# Altium project PCB_Project1.PrjPCB
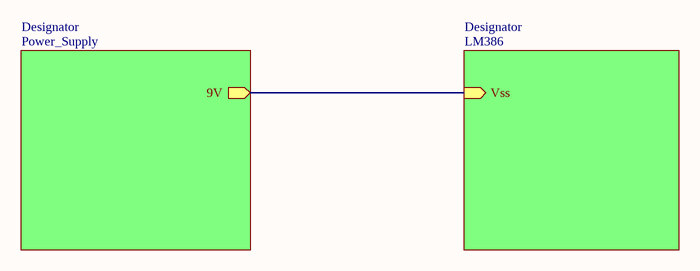
[diagram p0: Sheet1.SchDoc]
3 sheets, 38 parts. Net scope: hierarchical (ports join the sheet entries above them; power ports are global).
Sheets:
  Sheet1.SchDoc
    Designator = Power_Supply.SchDoc
    Designator = LM386.SchDoc

## Sheet Sheet1.SchDoc
size A4

### Sub-sheets
Designator = Power_Supply: 9V (out)
Designator = LM386: Vss (in)

### Nets
NetC11_2: sheet Designator/9V, sheet Designator/Vss

## Sheet Power_Supply.SchDoc
size A4
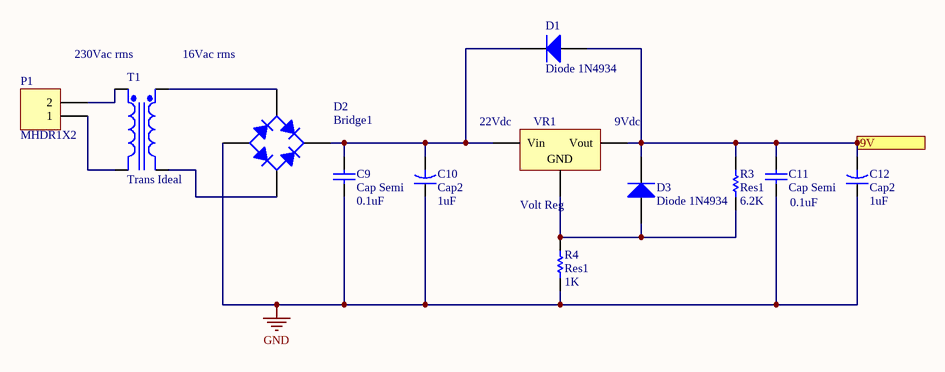
[diagram p1: Power_Supply.SchDoc]

### Parts
(Parts that share a designator on the sheet are numbered #1, #2 ... from top to bottom, then left to right.)
C9#1  Cap Semi  value 0.1uF  [C1206]
C10#1  Cap2  value 1uF  [CAPR5-4X5]
C11  Cap Semi  value 0.1uF  [C1206]
C12  Cap2  value 1uF  [CAPR5-4X5]
D1  Diode 1N4934  [DO-41]
D2  Bridge1  [D-38]
D3  Diode 1N4934  [DO-41]
P1  MHDR1X2  [MHDR1X2]
R3  Res1  value 6.2K  [AXIAL-0.3]
R4  Res1  value 1K  [AXIAL-0.3]
T1  Trans Ideal  [TRF_4]
VR1  Volt Reg  [D2PAK_N]

### Ports
9V (out)

### Nets
GND: C9#1.1 C10#1.1 C11.1 C12.1 D2.3(A) R4.1
NetC9#1_2: C9#1.2 C10#1.2 D1.2(K) D2.1(K) VR1.1(Vin)
NetC11_2: C11.2 C12.2 D1.1(A) D3.2(K) R3.1 VR1.3(Vout) ; port 9V
NetD2_2: D2.2(C) T1.4(Sec-)
NetD2_4: D2.4(C) T1.3(Sec+)
NetD3_1: D3.1(A) R3.2 R4.2 VR1.2(GND)
NetP1_1: P1.1 T1.2(Pri-)
NetP1_2: P1.2 T1.1(Pri+)

### Notes on the sheet
- 230Vac rms
- 16Vac rms
- (near VR1) 22Vdc
- (near VR1) 9Vdc

### Library data of the parts
C9#1 C11 = Cap Semi: Capacitor (Semiconductor SIM Model); Published: 8-Jun-2000; LatestRevisionDate: 29-May-2009; LatestRevisionNote: IPC-7351 Footprint Added.; PackageReference: C1206; Publisher: Altium Limited; PackageDescription: Chip Capacitor
C10#1 C12 = Cap2: Capacitor; Published: 23-Sep-2002; PackageReference: CAPR5-4X5; Publisher: Altium Limited; PackageDescription: Capacitor; 2 Leads
D1 D3 = Diode 1N4934: 1 Amp Fast Recovery Rectifier; Published: 8-Jun-2000; LatestRevisionDate: 17-Jul-2002; LatestRevisionNote: Re-released for DXP Platform.; DatasheetVersion: 1999; PackageVersion: Aug-1999; PackageReference: DO-41; Publisher: Altium Limited; PackageDescription: Diode, Axial; Body 5.2 x 2.7 mm (LxDia. max), Lead Dia. 0.86 mm (max); Code_JEDEC: DO-204-AL; ComponentLink1Description: Manufacturer Link; ComponentLink1URL: http://www.fairchildsemi.com/; ComponentLink2Description: Datasheet; ComponentLink2URL: http://www.fairchildsemi.com/ds/1N%2F1N4934.pdf
D2 = Bridge1: Full Wave Diode Bridge; Published: 8-Jun-2000; LatestRevisionDate: 29-May-2009; LatestRevisionNote: Sch pins A & K swapped.; DatasheetVersion: E2732B; PackageReference: D-38; Publisher: Altium Limited; PackageDescription: Bridge Rectifier; 4 Terminals; Body 9.4 x 9.4 mm (typ); Pitch 5.08 mm
P1 = MHDR1X2: Header, 2-Pin; LatestRevisionDate: 17-Jul-2002; LatestRevisionNote: Re-released for DXP Platform.; Publisher: Altium Limited
R3 R4 = Res1: Resistor; Published: 8-Jun-2000; LatestRevisionDate: 17-Jul-2002; LatestRevisionNote: Re-released for DXP Platform.; PackageReference: AXIAL-0.3; Publisher: Altium Limited; PackageDescription: Axial Device, Thru-Hole; 2 Leads; 0.3 in Pin Spacing
T1 = Trans Ideal: Transformer (Ideal); Published: 8-Jun-2000; LatestRevisionDate: 17-Jul-2002; LatestRevisionNote: Re-released for DXP Platform.; PackageReference: TRF_4; Publisher: Altium Limited; PackageDescription: Transformer; 4 Leads
VR1 = Volt Reg: Voltage Regulator; Published: 24-Mar-1999; LatestRevisionDate: 29-May-2009; LatestRevisionNote: IPC-7351 Footprint Added.; PackageReference: D2PAK; Publisher: Altium Limited; PackageDescription: 3-Pin Transistor Outline Package 2.54 mm Pitch, 15.1 mm Lead Span

## Sheet LM386.SchDoc
size A4
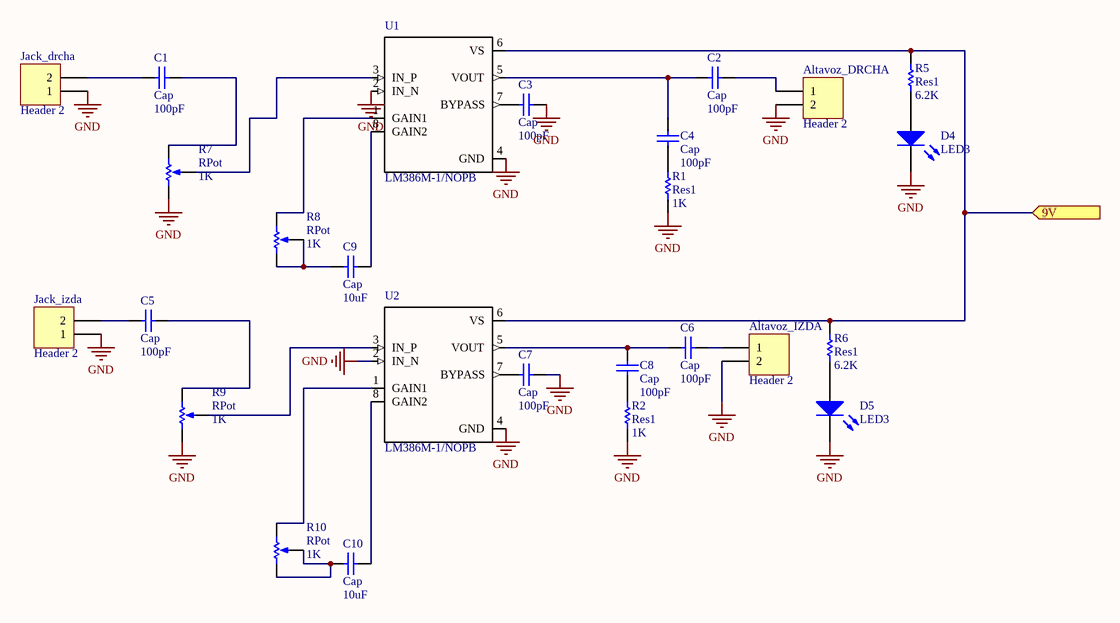
[diagram p2: LM386.SchDoc]

### Parts
(Parts that share a designator on the sheet are numbered #1, #2 ... from top to bottom, then left to right.)
Altavoz_DRCHA  Header 2  [HDR1X2]
Altavoz_IZDA  Header 2  [HDR1X2]
C1  Cap  value 100pF  [RAD-0.3]
C2  Cap  value 100pF  [RAD-0.3]
C3  Cap  value 100pF  [RAD-0.3]
C4  Cap  value 100pF  [RAD-0.3]
C5  Cap  value 100pF  [RAD-0.3]
C6  Cap  value 100pF  [RAD-0.3]
C7  Cap  value 100pF  [RAD-0.3]
C8  Cap  value 100pF  [RAD-0.3]
C9#2  Cap  value 10uF  [RAD-0.3]
C10#2  Cap  value 10uF  [RAD-0.3]
D4  LED3  [3.5X2.8X1.9]
D5  LED3  [3.5X2.8X1.9]
Jack_drcha  Header 2  [HDR1X2]
Jack_izda  Header 2  [HDR1X2]
R1  Res1  value 1K  [AXIAL-0.3]
R2  Res1  value 1K  [AXIAL-0.3]
R5  Res1  value 6.2K  [AXIAL-0.3]
R6  Res1  value 6.2K  [AXIAL-0.3]
R7  RPot  value 1K  [SOIC127P600X175-8N]
R8  RPot  value 1K  [VR5]
R9  RPot  value 1K  [VR5]
R10  RPot  value 1K  [VR5]
U1  LM386M-1/NOPB  [SOIC127P600X175-8N]
U2  LM386M-1/NOPB  [SOIC127P600X175-8N]

### Ports
9V (in)

### Nets
GND: Altavoz_DRCHA.2 Altavoz_IZDA.2 C3.1 C7.2 D4.2(K) D5.2(K) Jack_drcha.1 Jack_izda.1 R1.1 R2.1 R7.1(TOP) R9.1(TOP) U1.2(IN_N) U1.4(GND) U2.2(IN_N) U2.4(GND)
NetAltavoz_DRCHA_1: Altavoz_DRCHA.1 C2.2
NetAltavoz_IZDA_1: Altavoz_IZDA.1 C6.2
NetC1_1: C1.1 R7.2(BOT)
NetC1_2: C1.2 Jack_drcha.2
NetC2_1: C2.1 C4.2 U1.5(VOUT)
NetC3_2: C3.2 U1.7(BYPASS)
NetC4_1: C4.1 R1.2
NetC5_1: C5.1 R9.2(BOT)
NetC5_2: C5.2 Jack_izda.2
NetC6_1: C6.1 C8.2 U2.5(VOUT)
NetC7_1: C7.1 U2.7(BYPASS)
NetC8_1: C8.1 R2.2
NetC9#2_1: C9#2.1 U1.8(GAIN2)
NetC9#2_2: C9#2.2 R8.1(TOP) R8.3(TAP)
NetC10#2_1: C10#2.1 U2.8(GAIN2)
NetC10#2_2: C10#2.2 R10.1(TOP) R10.3(TAP)
NetD4_1: D4.1(A) R5.2
NetD5_1: D5.1(A) R6.2
NetR5_1: R5.1 R6.1 U1.6(VS) U2.6(VS) ; port 9V
NetR7_3: R7.3(TAP) U1.3(IN_P)
NetR8_2: R8.2(BOT) U1.1(GAIN1)
NetR9_3: R9.3(TAP) U2.3(IN_P)
NetR10_2: R10.2(BOT) U2.1(GAIN1)

### Library data of the parts
Altavoz_DRCHA Altavoz_IZDA Jack_drcha Jack_izda = Header 2: Header, 2-Pin; LatestRevisionDate: 17-Jul-2002; LatestRevisionNote: Re-released for DXP Platform.; Publisher: Altium Limited
C1-C8 C9#2 C10#2 = Cap: Capacitor; Published: 8-Jun-2000; LatestRevisionDate: 17-Jul-2002; LatestRevisionNote: Re-released for DXP Platform.; PackageReference: RAD-0.3; Publisher: Altium Limited; PackageDescription: Radial Cap, Thru-Hole; 2 Leads; 0.3 in Pin Spacing
D4 D5 = LED3: Typical BLUE SiC LED; Published: 8-Jun-2000; LatestRevisionDate: 17-Dec-2003; LatestRevisionNote: PCB Footprint replaced.; DatasheetVersion: 16-Apr-2002; PackageVersion: 16-Apr-2002; PackageReference: 3.5X2.8X1.9; Publisher: Altium Limited; PackageDescription: SM LED; 2 C-Bend Leads; Body 3.5 x 2.8 x 1.9 mm, inc leads (LxWxH typ)
R1 R2 R5 R6 = Res1: Resistor; Published: 8-Jun-2000; LatestRevisionDate: 17-Jul-2002; LatestRevisionNote: Re-released for DXP Platform.; PackageReference: AXIAL-0.3; Publisher: Altium Limited; PackageDescription: Axial Device, Thru-Hole; 2 Leads; 0.3 in Pin Spacing
R7-R10 = RPot: Potentiometer; Sim Note: Enter the Resistance value and the set point into parameter fields.; Set Position: 0.5; Published: 8-Jun-2000; LatestRevisionDate: 17-Jul-2002; LatestRevisionNote: Re-released for DXP Platform.; PackageReference: VR5; Publisher: Altium Limited; PackageDescription: Variable Resistor, Thru-Hole; 3 Leads
U1 U2 = LM386M-1/NOPB: Wide Input Voltage Low Power Audio Amplifier with Internal Gain 8-SOIC 0 to 70; MF: Texas Instruments; Price: 0.76 USD; MP: LM386M-1; Availability: Good; SnapEDA_Link: https://www.snapeda.com/parts/LM386M-1/Texas%20Instruments/view-part/?ref=snap; Package: SOIC-8 Texas Instruments; Value: *

## Nets that join several sheets
GND: Power_Supply (6 pins), LM386 (16 pins)